# EAGLE design Ambient Light Sensor (EAGLE 6.5.0)
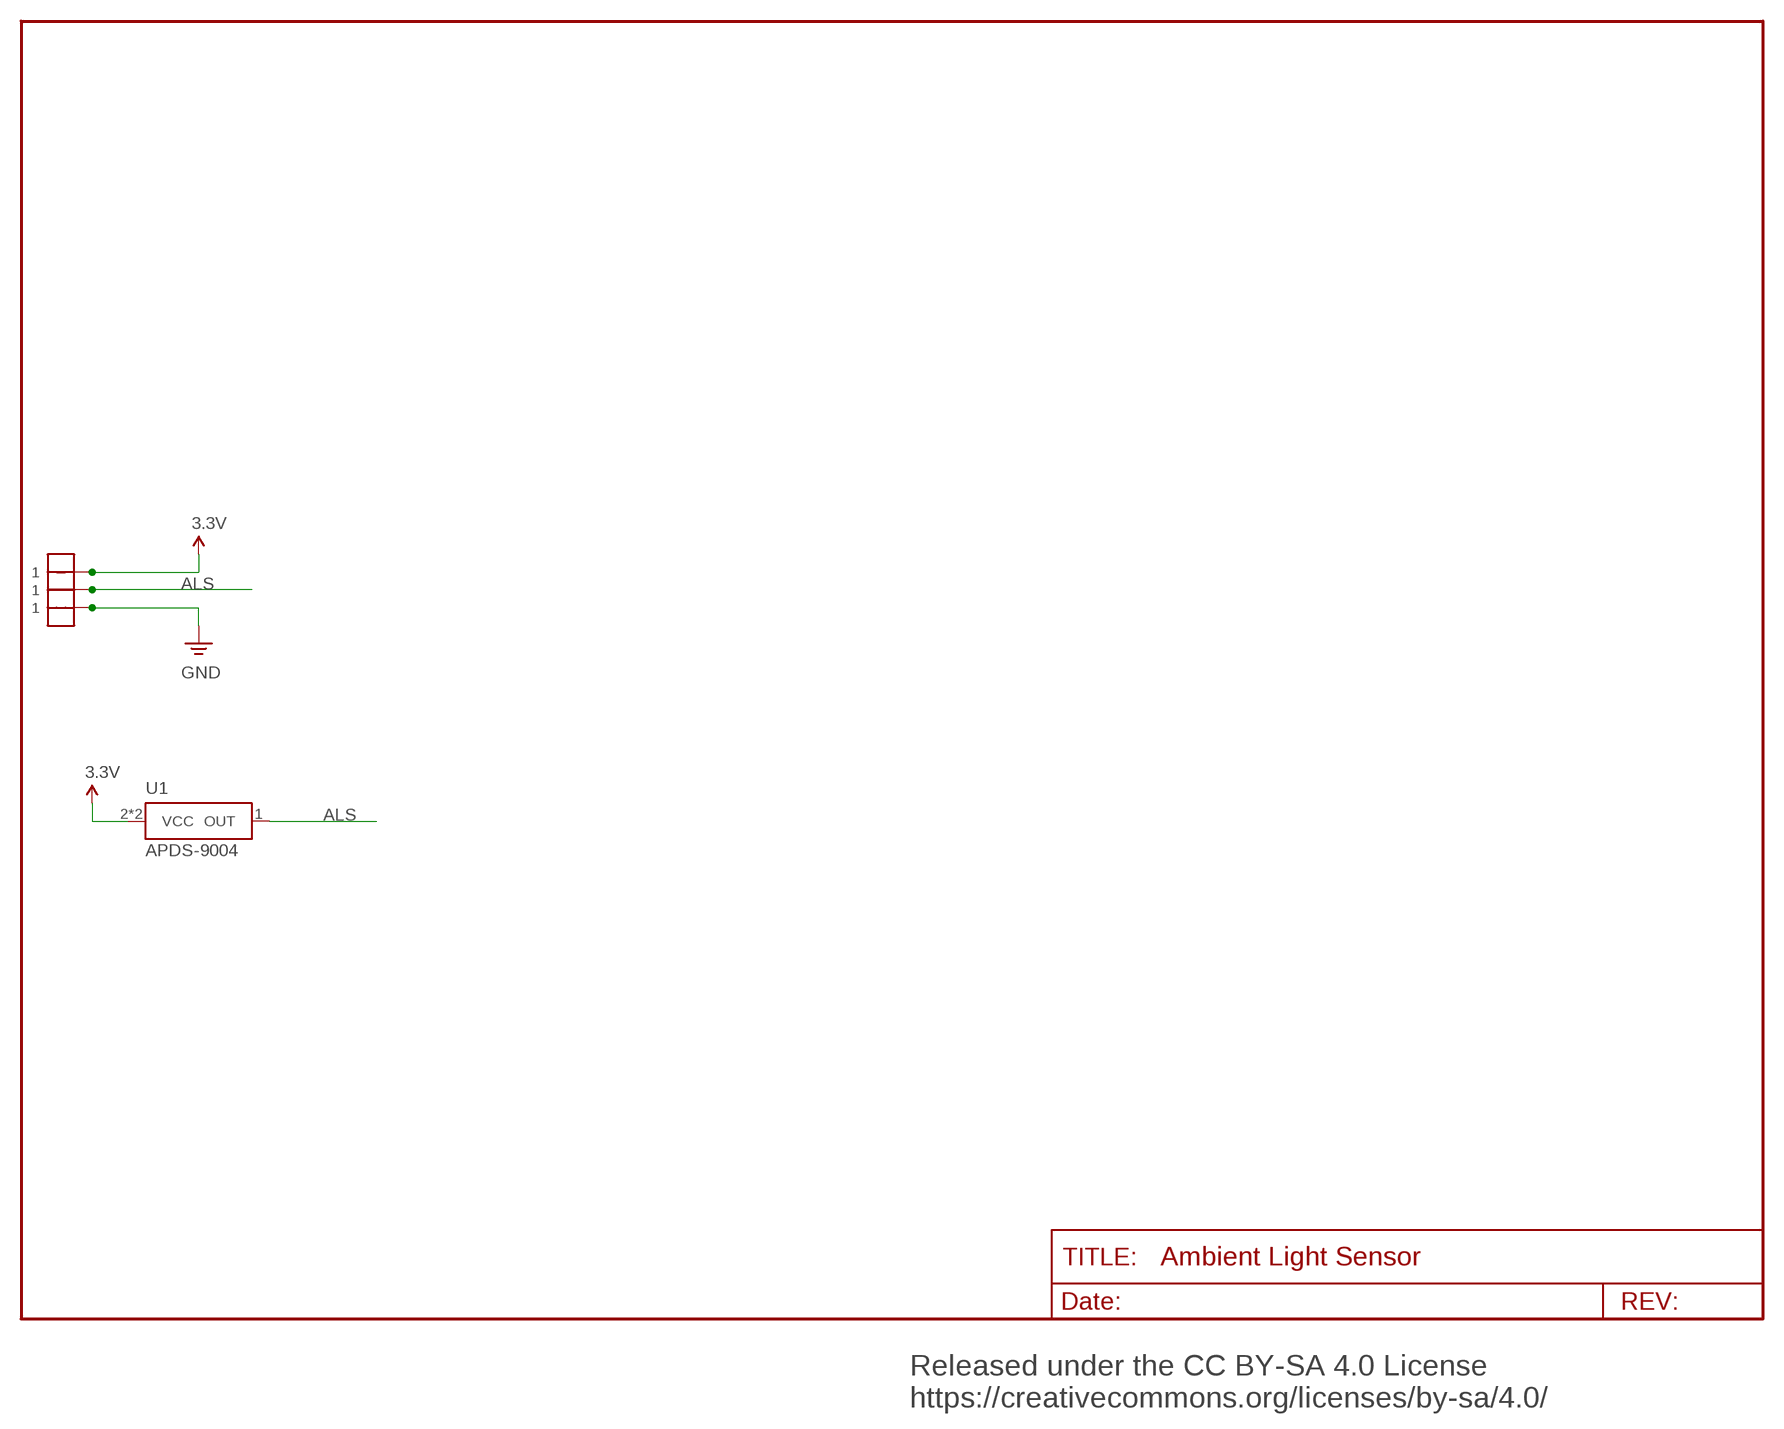
[diagram p0: schematic, sheet 1]

## Parts
U1  ADPS-9004  [APDS-9004]
U$2  S01-4MM  [S01-4MM]
U$3  S01-4MM  [S01-4MM]
U$4  S01-4MM  [S01-4MM]

## Nets
3.3V: U1.2(VCC) U1.3(VCC) U$2.P$1
ALS: U1.1(OUT) U$3.P$1
GND: U$4.P$1

## Notes on the sheet
- Released under the CC BY-SA 4.0 License 
  https://creativecommons.org/licenses/by-sa/4.0/

## Library data of the parts
U1 = L1:ADPS-9004
U$2-U$4 = pinhead-half:S01-4MM

## Net classes
1 Tline: width 0.003 mm, drill 0.33 mm

## Board
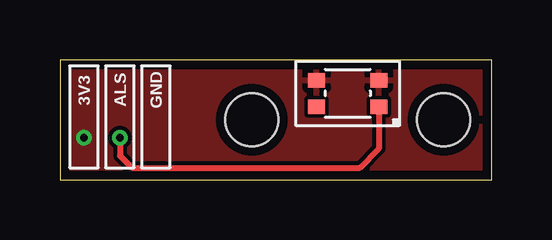
[diagram p1: board, top side]
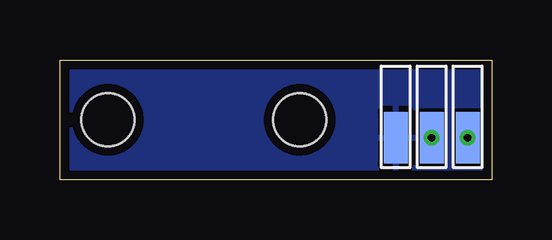
[diagram p2: board, bottom side, seen from below]

Size 18 x 5 mm. Coordinates in mm from the lower left corner, seen from the top.
Outline: 0,0 18,0 18,5 0,5 0,0
Copper layers (1*16): Top 0.0356mm / dielectric 1.5011mm / Bottom 0.0356mm
Design rules "LaenPCBOrder *": minimum track width 6mil, minimum drill 13mil, track to track 6mil, track to pad 6mil, pad to pad 6mil, via to via 6mil, smd to smd 6mil, copper to edge 15mil, drill to drill 6mil, minimum pad ring 7mil, minimum via ring 7mil, stop-mask expansion 3mil, vias tented up to drill 15mil, thermal gap 10mil
Holes 2.2 mm at 8,2.5 16,2.5

### Footprints (pad centres in the part's own frame; a part is rotated, then mirrored left to right if it is on the bottom)
APDS-9004 = smd 0.6 x 0.71: 1 0.55,1.3; 2 -0.55,1.3; 3 -0.55,-1.3; 4 0.55,-1.3
S01-4MM = smd 2.15 x 1: P$1 0,0

### Placement (x,y rotation side)
U1  12,3.6 270 top
U$2  1,1.75 90 bottom
U$3  2.5,1.75 90 bottom
U$4  4,1.75 90 bottom

### Tracks (layer width: path | path; a pad name or v marks a point on that pad's centre or on a via)
3.3V  (via drill 0.3)
  other vias: 1,1.75
  pour Top: -4,6 18.5,6 18.5,-0.25 -4,-0.25
ALS  (via drill 0.3)
  Top 0.25: U$3.P$1 2.5,1 3,0.5 12.5,0.5 13.3,1.3 U1.1
  other vias: 2.5,1.75
GND
  pour Bottom: -4.5,6.5 19,6.5 19,0.5 -4.5,0.5

### Text on the board
tNames: 3V3 / ALS / GND
tValues: Released under the CC BY-SA 4.0 License / https://creativecommons.org/licenses/by-sa/4.0/